# EAGLE design Moz_Mo_1_0 (EAGLE 7.1.0)
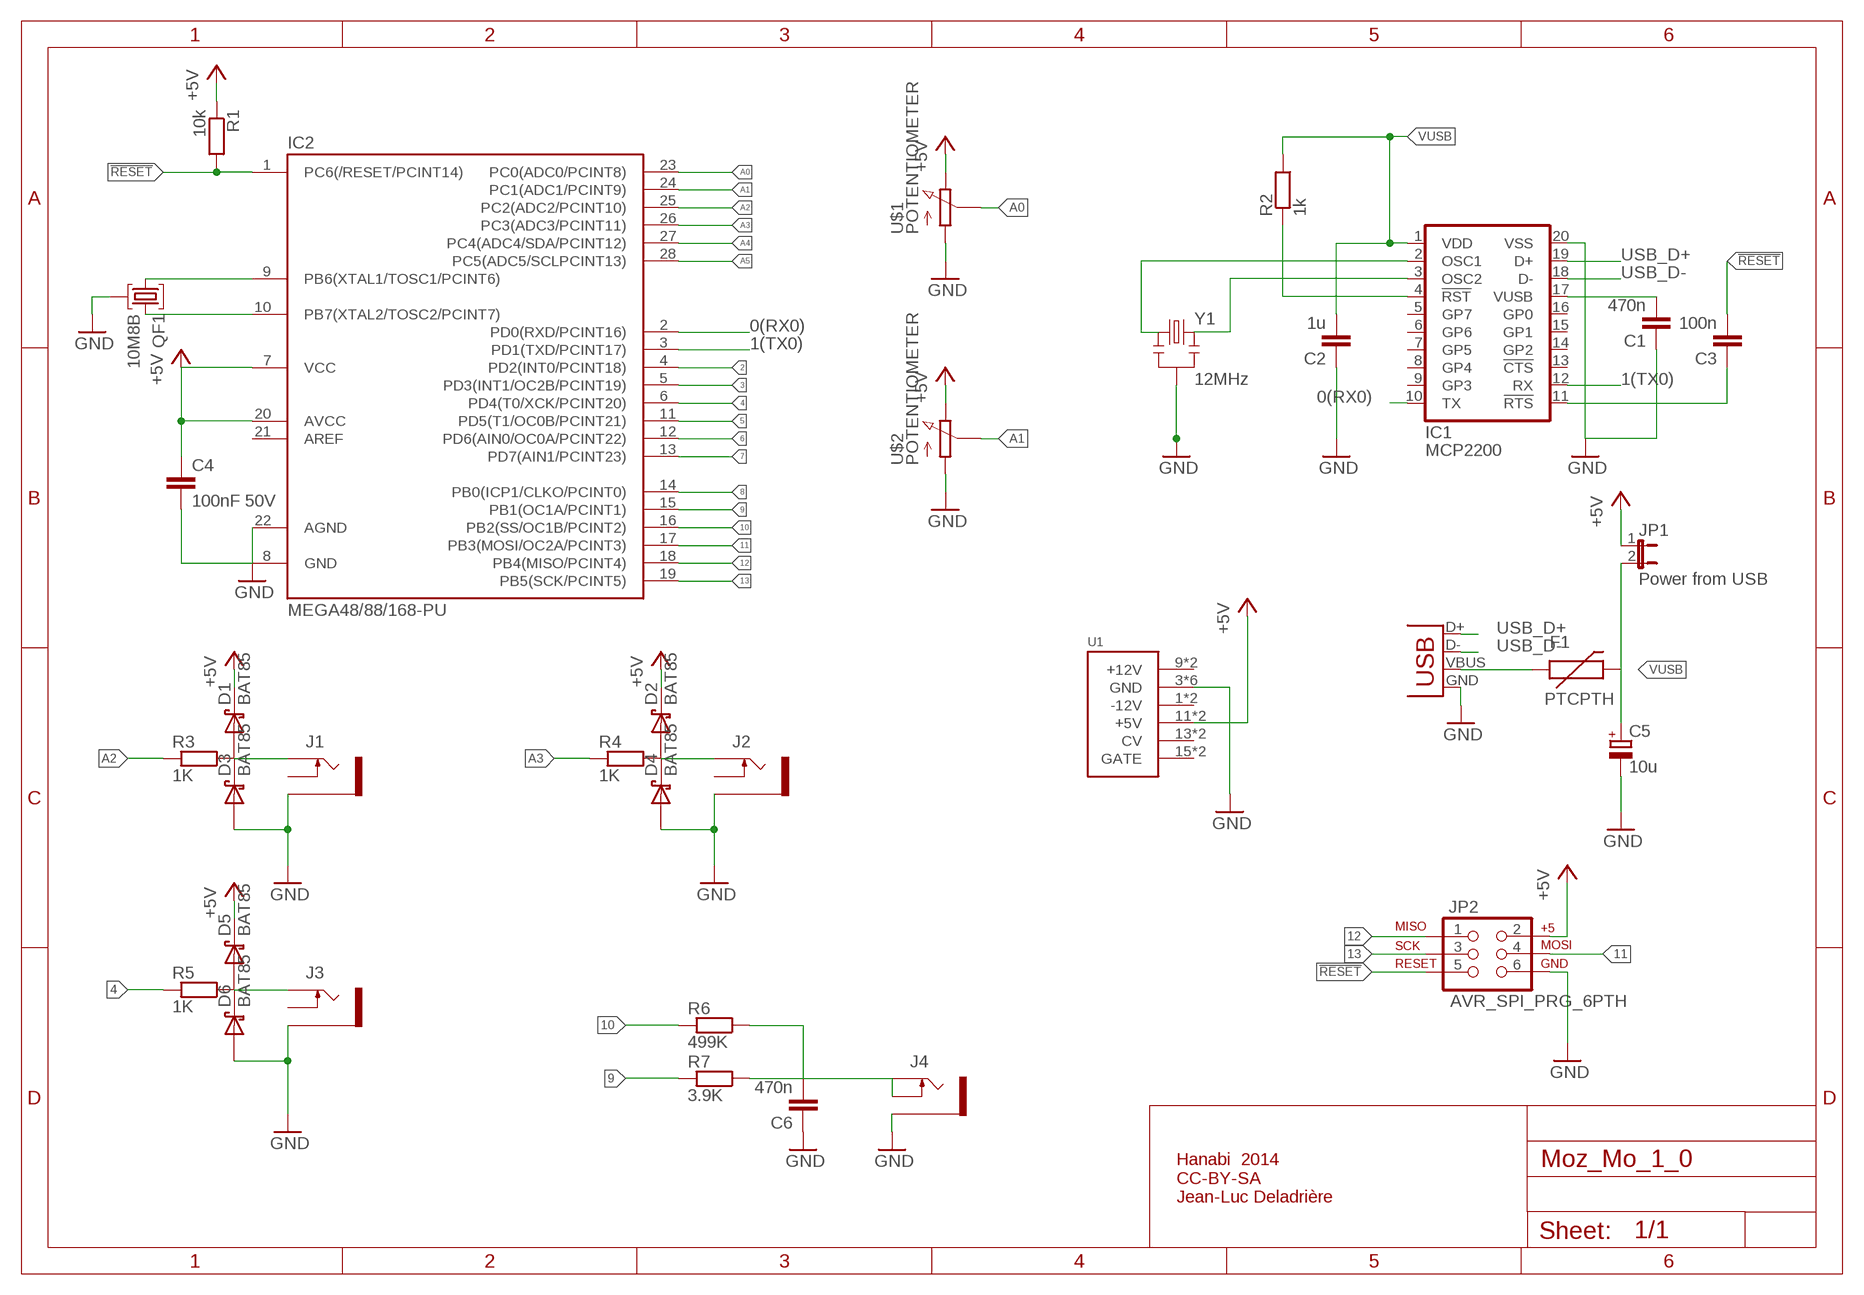
[diagram p0: schematic, sheet 1]

## Parts
C1  470n  CAPPTH  [CAP-PTH-SMALL]
C2  1u  CAPPTH1  [CAP-PTH-5MM]
C3  100n  CAPPTH  [CAP-PTH-SMALL]
C4  100nF 50V  C-EU025-025X050  [C025-025X050]
C5  10u  CPOL-EUE2.5-7  [E2,5-7]
C6  470n  CAPPTH  [CAP-PTH-SMALL]
D1  BAT85  DIODE-SCHOTTKY  [DIODE-TH-0.4]
D2  BAT85  DIODE-SCHOTTKY  [DIODE-TH-0.4]
D3  BAT85  DIODE-SCHOTTKY  [DIODE-TH-0.4]
D4  BAT85  DIODE-SCHOTTKY  [DIODE-TH-0.4]
D5  BAT85  DIODE-SCHOTTKY  [DIODE-TH-0.4]
D6  BAT85  DIODE-SCHOTTKY  [DIODE-TH-0.4]
F1  PTCPTH  [PTC]
IC1  MCP2200  [SO20]
IC2  MEGA48/88/168-PU  [DIL28-3]
J1  1503_12  [1503_12]
J2  1503_12  [1503_12]
J3  1503_12  [1503_12]
J4  1503_12  [1503_12]
JP1  Power from USB  JP1E  [JP1]
JP2  AVR_SPI_PRG_6PTH  [2X3]
QF1  10M8B  [HC49U]
R1  10k  RESISTOR  [RES-AXIAL-0.4]
R2  1k  RESISTOR  [RES-AXIAL-0.4]
R3  1K  RESISTOR  [RES-AXIAL-0.4]
R4  1K  RESISTOR  [RES-AXIAL-0.4]
R5  1K  RESISTOR  [RES-AXIAL-0.4]
R6  499K  RESISTOR  [RES-AXIAL-0.4]
R7  3.9K  RESISTOR  [RES-AXIAL-0.4]
U1  POWER  [POWER_16]
U$1  POTENTIOMETER  [POTENTIOMETER]
U$2  POTENTIOMETER  [POTENTIOMETER]
X1  USB  USBPTH  [USB-B-PTH]
Y1  12MHz  CRYSTAL-RESONATOR  [HC49U-V-RESONATOR]

## Nets
0(RX0): IC1.10(TX) IC2.2(PD0(RXD/PCINT16))
1(TX0): IC1.12(RX) IC2.3(PD1(TXD/PCINT17))
2: IC2.4(PD2(INT0/PCINT18))
3: IC2.5(PD3(INT1/OC2B/PCINT19))
4: IC2.6(PD4(T0/XCK/PCINT20)) R5.P$1
5: IC2.11(PD5(T1/OC0B/PCINT21))
6: IC2.12(PD6(AIN0/OC0A/PCINT22))
7: IC2.13(PD7(AIN1/PCINT23))
8: IC2.14(PB0(ICP1/CLKO/PCINT0))
9: IC2.15(PB1(OC1A/PCINT1)) R7.P$1
10: IC2.16(PB2(SS/OC1B/PCINT2)) R6.P$1
11: IC2.17(PB3(MOSI/OC2A/PCINT3)) JP2.4
12: IC2.18(PB4(MISO/PCINT4)) JP2.1
13: IC2.19(PB5(SCK/PCINT5)) JP2.3
!RESET: C3.2 IC2.1(PC6(/RESET/PCINT14)) JP2.5 R1.P$2
+5V [power]: C4.1 D1.C D2.C D5.C IC2.7(VCC) IC2.20(AVCC) JP1.1 JP2.2 R1.P$1 U1.11(+5V) U1.12(+5V) U$1.P$1(E) U$2.P$1(E)
A0: IC2.23(PC0(ADC0/PCINT8)) U$1.P$2(S)
A1: IC2.24(PC1(ADC1/PCINT9)) U$2.P$2(S)
A2: IC2.25(PC2(ADC2/PCINT10)) R3.P$1
A3: IC2.26(PC3(ADC3/PCINT11)) R4.P$1
A4: IC2.27(PC4(ADC4/SDA/PCINT12))
A5: IC2.28(PC5(ADC5/SCLPCINT13))
AUTO_RESET: C3.1 IC1.11(!RTS)
GND [power]: C1.1 C2.1 C4.2 C5.- C6.1 D3.A D4.A D6.A IC1.20(VSS) IC2.8(GND) IC2.22(AGND) J1.5 J2.5 J3.5 J4.5 JP2.6 QF1.2 U1.3(GND) U1.4(GND) U1.5(GND) U1.6(GND) U1.7(GND) U1.8(GND) U$1.P$3(A) U$2.P$3(A) X1.GND Y1.GND
N$1 [power]: F1.P$1 X1.VBUS
N$2: D1.A D3.C J1.3 R3.P$2
N$3: IC2.9(PB6(XTAL1/TOSC1/PCINT6)) QF1.1
N$4: D2.A D4.C J2.3 R4.P$2
N$5: D5.A D6.C J3.3 R5.P$2
N$6: C6.2 J4.3 J4.4 R6.P$2 R7.P$2
N$7: IC1.3(OSC2) Y1.2
N$12: IC2.10(PB7(XTAL2/TOSC2/PCINT7)) QF1.3
N$14: C1.2 IC1.17(VUSB)
N$18: IC1.2(OSC1) Y1.1
N$21: IC1.4(!RST) R2.P$1
USB_D+: IC1.19(D+) X1.D+
USB_D-: IC1.18(D-) X1.D-
VUSB [power]: C2.2 C5.+ F1.P$2 IC1.1(VDD) JP1.2 R2.P$2
Unconnected: IC1.5(GP7) IC1.6(GP6) IC1.7(GP5) IC1.8(GP4) IC1.9(GP3) IC1.13(!CTS) IC1.14(GP2) IC1.15(GP1) IC1.16(GP0) IC2.21(AREF) J1.4 J2.4 J3.4 U1.1(-12V) U1.2(-12V) U1.9(+12V) U1.10(+12V) U1.13(CV) U1.14(CV) U1.15(GATE) U1.16(GATE)

## Notes on the sheet
- Hanabi  2014
  CC-BY-SA
  Jean-Luc Deladrière

## Library data of the parts
C1 C6 = SparkFun:CAP: Capacitor Standard 0603 ceramic capacitor, and 0.1" leaded capacitor.; OC_FARNELL: 1457660
C2 = SparkFun:CAP: Capacitor Standard 0603 ceramic capacitor, and 0.1" leaded capacitor.; OC_FARNELL: 2112910
C3 = SparkFun:CAP: Capacitor Standard 0603 ceramic capacitor, and 0.1" leaded capacitor.; OC_FARNELL: 1216438
C4 = rcl:C-EU: CAPACITOR, European symbol; OC_FARNELL: 1216438
C5 = rcl:CPOL-EU: POLARIZED CAPACITOR, European symbol; OC_FARNELL: 1236657
D1-D6 = SteveMarple:DIODE-SCHOTTKY; OC_FARNELL: 1612329
F1 = SparkFun:PTC: Resettable Fuse PTC Resettable Fuse. Spark Fun Electronics SKU : COM-08357; OC_FARNELL: 1175860
IC1 = SteveMarple:MCP2200: MCP2200 Microchip USB-UART interface.; OC_FARNELL: 1781148
IC2 = avr-7:MEGA48/88/168-PU; OC_FARNELL: 1715487
J1-J4 = og-lumberg:1503_12; OC_FARNELL: 1340604
JP1 = jumper:JP1E: JUMPER
JP2 = SparkFun:AVR_SPI_PRG_6: AVR ISP 6 Pin This is the reduced ISP connector for AVR programming. Common on Arduino. This footprint will take up less PCB space and can be used with a 10-pin to 6-pin adapter such as SKU: BOB-08508; OC_FARNELL: 1248132
QF1 = crystal:10M*B: Monolithic Crystal Filters Source: www.vanlong.com; OC_FARNELL: 1448129; OC_NEWARK: unknown
R1-R7 = SteveMarple:RESISTOR: 1/4W PTH resistor
U1 = eurorack:POWER; OC_FARNELL: 3418510
U$1 U$2 = Custom_pot:POTENTIOMETER; OC_FARNELL: 1227586
X1 = SteveMarple:USB: USB Connectors USB-B-PTH is fully proven SKU : PRT-00139 USB-miniB is fully proven SKU : PRT-00587 USB-A-PCB is untested. USB-A-H is throughly reviewed, but untested. Spark Fun Electronics SKU : PRT-00437 USB-B-SMT is throughly reviewed, but untested. Needs silkscreen touching up. USB-A-S has not been used/tested USB-MB-H has not been used/tested; 0C_FARNELL: 1308876
Y1 = SteveMarple:CRYSTAL-RESONATOR: Crystal/resonator; OC_FARNELL: 1448128; OPTION: Crystal or ceramic resonator. Max 12MHz for 3V3 operation.

## Net classes
1 power: width 0.381 mm

## Board
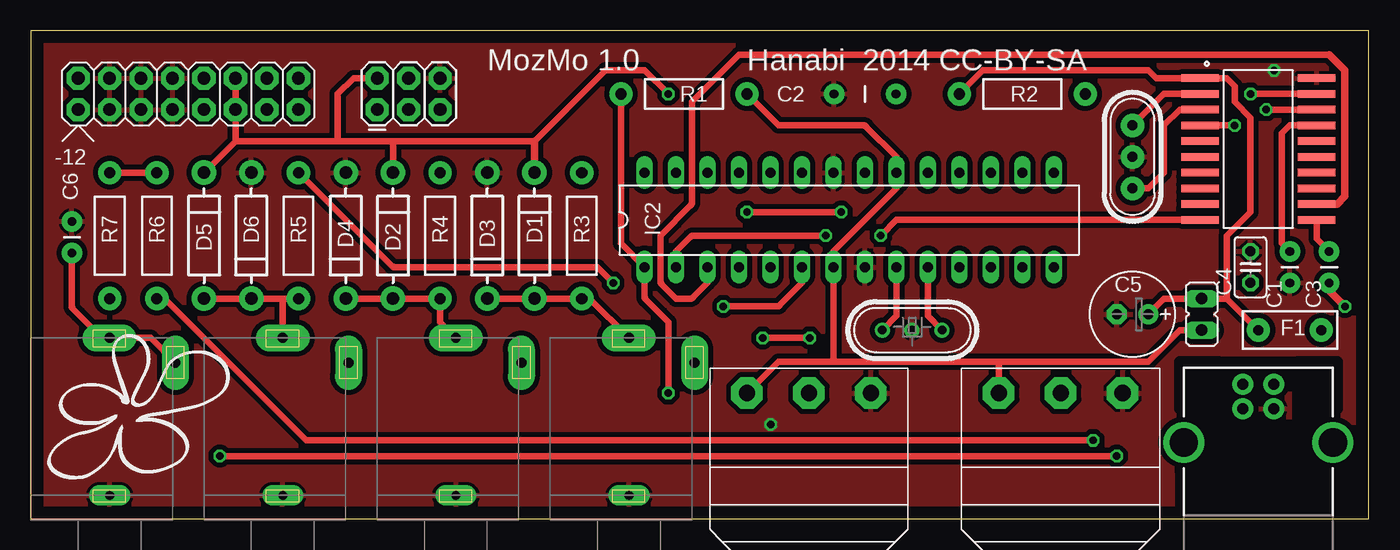
[diagram p1: board, top side]
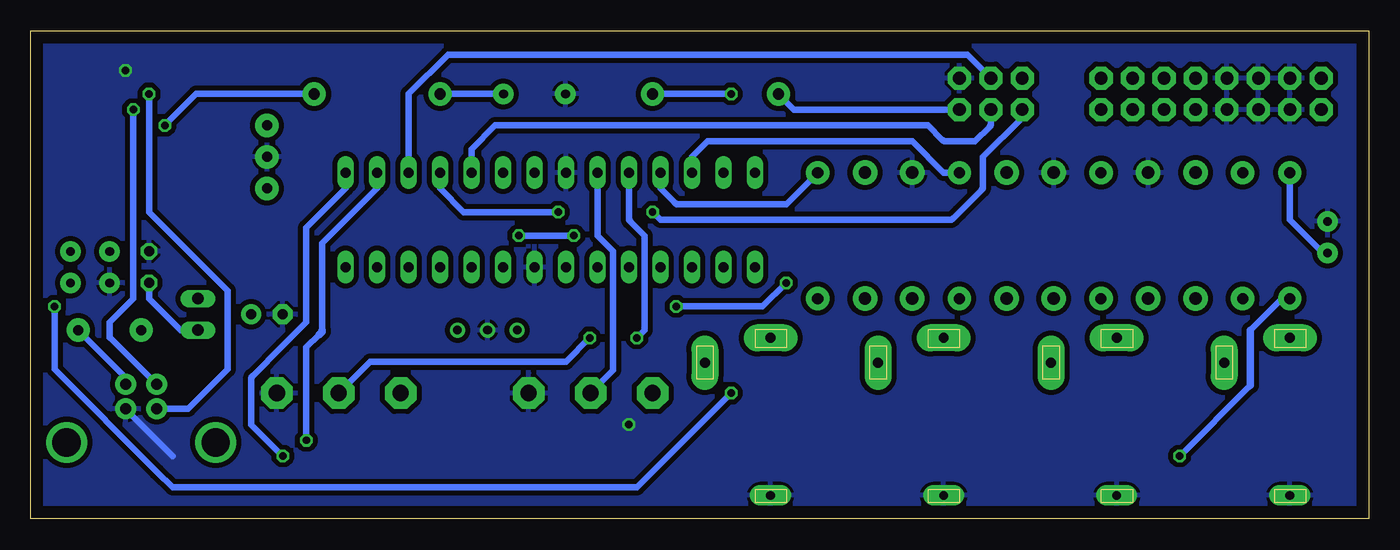
[diagram p2: board, bottom side, seen from below]

Size 107.95 x 39.37 mm. Coordinates in mm from the lower left corner, seen from the top.
Outline: 0,0 107.95,0 107.95,39.37 0,39.37 0,0
Copper layers (1*16): Top 0.035mm / dielectric 1.5mm / Bottom 0.035mm
Design rules "default": minimum track width 10mil, minimum drill 24mil, track to track 8mil, track to pad 8mil, pad to pad 8mil, via to via 8mil, smd to smd 8mil, copper to edge 40mil, drill to drill 8mil, minimum pad ring 10mil, minimum via ring 8mil, stop-mask expansion 4mil, vias tented up to drill 0mil, thermal gap 10mil

### Footprints (pad centres in the part's own frame; a part is rotated, then mirrored left to right if it is on the bottom)
CAP-PTH-SMALL = drill 0.7 pad 1.651: 1 0,0; 2 2.54,0
CAP-PTH-5MM = drill 0.7 pad 1.651: 1 -2.5,0; 2 2.5,0
C025-025X050 = drill 0.813 octagon: 1 -1.27,0; 2 1.27,0
E2,5-7 = drill 0.813 pad 1.6: + -1.27,0 | drill 0.813 pad 1.6 octagon: - 1.27,0
DIODE-TH-0.4 = drill 1 pad 1.981: A -5.08,0; C 5.08,0
PTC = drill 0.8 pad 1.88: P$1 -2.54,0; P$2 2.54,0
SO20 = smd 0.61 x 3.048: 1 -5.715,-4.699; 2 -4.445,-4.699; 3 -3.175,-4.699; 4 -1.905,-4.699; 5 -0.635,-4.699; 6 0.635,-4.699; 7 1.905,-4.699; 8 3.175,-4.699; 9 4.445,-4.699; 10 5.715,-4.699; 11 5.715,4.699; 12 4.445,4.699; 13 3.175,4.699; 14 1.905,4.699; 15 0.635,4.699; 16 -0.635,4.699; 17 -1.905,4.699; 18 -3.175,4.699; 19 -4.445,4.699; 20 -5.715,4.699
DIL28-3 = drill 0.813 long: 1 -16.51,-3.81; 2 -13.97,-3.81; 3 -11.43,-3.81; 4 -8.89,-3.81; 5 -6.35,-3.81; 6 -3.81,-3.81; 7 -1.27,-3.81; 8 1.27,-3.81; 9 3.81,-3.81; 10 6.35,-3.81; 11 8.89,-3.81; 12 11.43,-3.81; 13 13.97,-3.81; 14 16.51,-3.81; 15 16.51,3.81; 16 13.97,3.81; 17 11.43,3.81; 18 8.89,3.81; 19 6.35,3.81; 20 3.81,3.81; 21 1.27,3.81; 22 -1.27,3.81; 23 -3.81,3.81; 24 -6.35,3.81; 25 -8.89,3.81; 26 -11.43,3.81; 27 -13.97,3.81; 28 -16.51,3.81
1503_12 = drill 0.8 pad 2.184 long: 3 0,0; 4 2,5.3 | drill 0.7 pad 1.67 long: 5 12.7,0
JP1 = drill 0.914 long: 1 0,-1.27; 2 0,1.27
2X3 = drill 1.016 pad 1.88 octagon: 1 0,0; 2 0,2.54; 3 2.54,0; 4 2.54,2.54; 5 5.08,0; 6 5.08,2.54
HC49U = drill 0.7 pad 1.2: 1 -2.413,0; 2 -0.027,0; 3 2.413,0
RES-AXIAL-0.4 = drill 0.9 pad 1.88: P$1 -5.08,0; P$2 5.08,0
POWER_16 = drill 1.016 pad 1.88 octagon: 1 -6.35,-1.27; 2 -6.35,1.27; 3 -3.81,-1.27; 4 -3.81,1.27; 5 -1.27,-1.27; 6 -1.27,1.27; 7 1.27,-1.27; 8 1.27,1.27; 9 3.81,-1.27; 10 3.81,1.27; 11 6.35,-1.27; 12 6.35,1.27; 13 8.89,-1.27; 14 8.89,1.27; 15 11.43,-1.27; 16 11.43,1.27
POTENTIOMETER = drill 1.3 pad 2.54 octagon: P$1 -5.08,7.62; P$2 -0.08,7.62; P$3 4.92,7.62
USB-B-PTH = drill 0.914 pad 1.676: D+ 0,1.25; D- 1.981,1.25; GND 0,-1.25; VBUS 1.981,-1.25 | drill 2.286: S1 -2.718,-6.02; S2 -2.718,6.02
HC49U-V-RESONATOR = drill 0.813 pad 1.88: 1 -2.54,0; 2 2.54,0; GND 0,0

### Placement (x,y rotation side)
C1  101.6,19.05 90 top
C2  67.31,34.29 0 top
C3  104.78,21.59 270 top
C4  98.42,20.32 90 top
C5  88.9,16.51 180 top
C6  3.3,24 270 top
D1  40.64,22.86 90 top
D2  29.21,22.86 90 top
D3  36.83,22.86 270 top
D4  25.4,22.86 270 top
D5  13.97,22.86 90 top
D6  17.78,22.86 270 top
F1  101.6,15.24 180 top
IC1  99.06,29.84 270 top
IC2  66.04,24.13 0 top
J1  48.26,14.61 270 top
J2  34.29,14.61 270 top
J3  20.32,14.61 270 top
J4  6.35,14.61 270 top
JP1  94.49,16.51 0 top
JP2  27.94,33.02 0 top
QF1  71.12,15.24 0 top
R1  52.7,34.29 180 top
R2  80.01,34.29 180 top
R3  44.45,22.86 270 top
R4  33.02,22.86 270 top
R5  21.59,22.86 270 top
R6  10.16,22.86 90 top
R7  6.35,22.86 90 top
U1  10.16,34.29 0 top
U$1  62.87,2.54 0 top
U$2  83.19,2.54 0 top
U$3  [LOGO_HANABI]  0,2.54 0 top
X1  99.06,8.89 90 top
Y1  88.9,29.21 270 top

### Tracks (layer width: path | path; a pad name or v marks a point on that pad's centre or on a via)
0(RX0)  (via drill 0.6)
  Top 0.508: IC1.10 69.85,24.13 v68.58,22.86 | v64.14,22.86 57.15,22.86 53.47,22.86 arc45 53.25,22.77 52.07,21.59 IC2.2
  Bottom 0.508: v68.58,22.86 v64.14,22.86
1(TX0)
  Top 0.508: IC1.12 105.41,25.4 106.05,26.04 106.05,36.2 104.78,37.47 57.15,37.47 53.43,33.75 arc45 53.34,33.52 53.34,25.53 arc-45 53.25,25.31 50.8,22.86 50.8,19.18 arc45 50.89,18.96 52.07,17.78 53.21,17.78 arc45 53.43,17.87 54.61,19.05 IC2.3
  Top 0.61: IC1.12 105.41,25.4 106.05,26.04 106.05,36.2 104.78,37.47
4  (via drill 0.6)
  Top 0.508: R5.P$1 29.12,20.41 arc45 29.34,20.32 45.72,20.32 v46.99,19.05 | v55.88,17.14 60.19,17.14 arc45 60.42,17.24 62.23,19.05 IC2.6
  Bottom 0.508: v46.99,19.05 48.9,17.14 v55.88,17.14
9  (via drill 0.6)
  Top 0.508: v15.24,5.08 v87.63,5.08
  Bottom 0.508: 9.53,10.93 arc45 9.62,10.7 | R7.P$1 6.99,17.78 9.53,15.24 9.53,10.79 v15.24,5.08 | IC2.15 82.55,26.67 85.72,23.5 85.72,20.95 85.72,18.41 85.72,17.78 85.72,15.88 87.63,13.97 90.08,11.52 arc-45 90.17,11.3 90.17,7.62 v87.63,5.08
  Bottom 0.61: 9.53,15.24 9.53,10.93 | 9.53,10.93 9.53,10.79 | 9.53,10.79 9.53,10.93 | 9.53,10.93 9.53,10.79 | 9.53,10.79 9.53,10.93 | 9.53,10.93 9.53,10.79 | 9.53,10.79 9.53,10.93
10  (via drill 0.6)
  Top 0.508: R6.P$1 10.66,17.78 arc-45 10.89,17.69 22.23,6.35 83.05,6.35 v85.72,6.35
  Bottom 0.508: v85.72,6.35 85.72,13.84 84.71,14.86 84.45,15.11 84.45,22.23 80.01,26.67 IC2.16
  Bottom 0.61: 84.45,15.24 84.45,15.11 84.71,14.86
11
  Bottom 0.508: JP2.4 32.38,37.47 74.3,37.47 77.47,34.29 77.47,30.48 IC2.17
12  (via drill 0.6)
  Top 0.508: v57.78,24.77 v65.41,24.77
  Bottom 0.508: JP2.1 27.94,32.52 arc45 28.03,32.29 31.11,29.21 31.11,26.8 arc45 31.21,26.58 33.02,24.77 33.56,24.22 arc45 33.79,24.13 56.38,24.13 57.15,24.13 v57.78,24.77 | v65.41,24.77 73.03,24.77 74.93,26.67 IC2.18
13
  Bottom 0.508: JP2.3 30.48,31.88 arc45 30.57,31.66 31.75,30.48 34.16,30.48 arc45 34.38,30.57 35.56,31.75 70.48,31.75 72.39,29.84 IC2.19
!RESET  (via drill 0.6)
  Top 0.508: C3.2 104.78,18.41 v106.05,17.14 | v51.44,10.16 51.44,15.88 49.62,17.69 arc-45 49.53,17.91 IC2.1 47.62,22.23 47.62,32.38 R1.P$2
  Top 0.61: C3.2 104.78,18.41 v106.05,17.14
  Bottom 0.508: v106.05,17.14 106.05,12.06 97.79,3.81 96.52,2.54 59.05,2.54 v51.44,10.16 | JP2.5 46.35,33.02 R1.P$2
+5V  (via drill 0.6)
  Top 0.508: 16.51,30.48 U1.11 U1.12 | 16.51,30.48 D5.C | JP2.2 26.04,35.56 24.77,34.29 24.77,30.48 | 24.77,30.48 16.51,30.48 | D2.C 29.21,30.48 | 29.21,30.48 24.77,30.48 | 64.77,12.7 69.85,12.7 78.11,12.7 | 64.77,12.7 60.33,12.7 U$1.P$1 | 64.77,12.7 64.77,17.14 IC2.7 64.77,21.59 69.85,26.67 IC2.20 69.85,29.21 67.4,31.66 arc45 67.18,31.75 60.33,31.75 R1.P$1 | JP1.1 92.71,15.24 90.17,12.7 78.11,12.7 | 40.64,30.48 29.21,30.48 | 40.64,30.48 D1.C | 40.64,30.48 46.35,36.2 49.53,36.2 v51.44,34.29 | U$2.P$1 78.11,12.7
  Top 0.61: D1.C 40.64,30.48
  Bottom 0.508: JP1.1 95.89,15.24 98.42,17.78 C4.1 | R1.P$1 v51.44,34.29
A0
  Bottom 0.508: IC2.23 62.23,22.86 60.96,21.59 60.96,11.98 U$1.P$2
A1  (via drill 0.6)
  Top 0.508: v62.87,14.61 v59.05,14.61
  Bottom 0.508: IC2.24 59.69,24.26 arc-45 59.6,24.04 58.42,22.86 58.42,15.24 v59.05,14.61 | v62.87,14.61 64.77,12.7 80.56,12.7 U$2.P$2
A2
  Bottom 0.508: R3.P$1 46.99,25.4 52.07,25.4 55.75,25.4 arc45 55.97,25.49 57.15,26.67 IC2.25
A3
  Bottom 0.508: R4.P$1 34.29,27.94 36.83,30.48 53.34,30.48 54.61,29.21 IC2.26
AUTO_RESET
  Top 0.508: IC1.11 103.76,22.61 C3.1
GND  (via drill 0.6)
  Bottom 0.508: X1.GND 100.31,8.87 96.52,5.08
  other vias: 100.33,36.2 59.69,7.62
  pour Bottom (isolate 0.406): 0,39.37 107.95,39.37 107.95,0 0,0
  pour Top (isolate 0.406): 0,0 0,39.37 109.22,39.37 109.22,0
N$1
  Bottom 0.508: X1.VBUS 100.31,11.41 F1.P$1
N$2
  Top 0.508: J1.3 45.09,17.78 R3.P$2 D1.A D3.C
N$3
  Top 0.508: IC2.9 69.85,16.38 QF1.1
N$4
  Top 0.508: J2.3 33.02,15.88 R4.P$2 D2.A D4.C
N$5
  Top 0.508: R5.P$2 20.32,17.78 | 20.32,17.78 D6.C D5.A | J3.3 20.32,17.78
N$6
  Top 0.508: J4.4 9.65,14.61 J4.3 5.85,14.61 arc-45 5.62,14.7 3.81,16.51 3.4,16.93 arc-45 3.3,17.15 C6.2 | R7.P$2 R6.P$2
  Bottom 0.508: C6.2 3.68,21.46 6.35,24.13 R7.P$2
N$7
  Top 0.508: IC1.3 92.71,33.02 91.44,31.75 91.44,27.94 90.17,26.67 Y1.2
N$12
  Top 0.508: IC2.10 72.39,16.38 QF1.3
N$14
  Top 0.508: IC1.17 101.6,31.75 100.97,31.11 100.97,22.23 C1.2
N$18
  Top 0.508: IC1.2 91.44,34.29 Y1.1
N$21  (via drill 0.6)
  Top 0.508: IC1.4 v97.16,31.75
  Bottom 0.508: R2.P$1 94.61,34.29 v97.16,31.75
USB_D+  (via drill 0.6)
  Top 0.508: IC1.19 v98.42,34.29
  Bottom 0.508: X1.D+ 95.25,8.89 92.08,12.06 92.08,18.41 98.42,24.77 v98.42,34.29
  Bottom 0.61: X1.D+ 97.79,8.89
USB_D-  (via drill 0.6)
  Top 0.508: IC1.18 v99.69,33.02
  Bottom 0.508: v99.69,33.02 99.69,17.78 101.6,15.88 101.6,14.61 101.54,14.61 X1.D-
VUSB
  Top 0.508: 96.52,17.78 JP1.2 91.44,17.78 C5.+ | 96.52,17.78 F1.P$2 | R2.P$2 76.83,36.2 90.17,36.2 90.81,35.56 IC1.1 96.52,35.56 97.16,34.92 97.16,33.66 98.42,32.38 98.42,24.77 96.52,22.86 96.52,17.78
  Bottom 0.508: C2.2 R2.P$2

### Text on the board
tNames: MozMo 1.0 | Hanabi 2014 CC-BY-SA